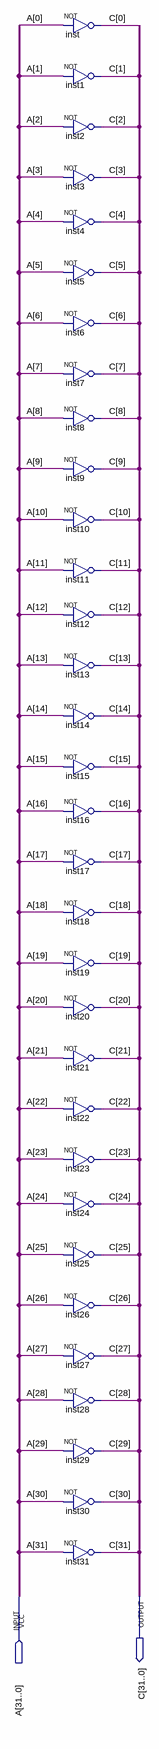
[diagram p0: schematic sheet]
// Quartus schematic logical_not.bdf as structural Verilog: 32 symbols, 2 pins
module logical_not (
  input  [31:0] A,
  output [31:0] C
);

  not inst (C[0], A[0]);
  not inst1 (C[1], A[1]);
  not inst2 (C[2], A[2]);
  not inst3 (C[3], A[3]);
  not inst4 (C[4], A[4]);
  not inst5 (C[5], A[5]);
  not inst6 (C[6], A[6]);
  not inst7 (C[7], A[7]);
  not inst8 (C[8], A[8]);
  not inst9 (C[9], A[9]);
  not inst10 (C[10], A[10]);
  not inst11 (C[11], A[11]);
  not inst12 (C[12], A[12]);
  not inst13 (C[13], A[13]);
  not inst14 (C[14], A[14]);
  not inst15 (C[15], A[15]);
  not inst16 (C[16], A[16]);
  not inst17 (C[17], A[17]);
  not inst18 (C[18], A[18]);
  not inst19 (C[19], A[19]);
  not inst20 (C[20], A[20]);
  not inst21 (C[21], A[21]);
  not inst22 (C[22], A[22]);
  not inst23 (C[23], A[23]);
  not inst24 (C[24], A[24]);
  not inst25 (C[25], A[25]);
  not inst26 (C[26], A[26]);
  not inst27 (C[27], A[27]);
  not inst28 (C[28], A[28]);
  not inst29 (C[29], A[29]);
  not inst30 (C[30], A[30]);
  not inst31 (C[31], A[31]);
endmodule
